# Altium schematic sheet 3.3V Buck Converter.SchDoc
size A; SheetNumber: 4; SheetTotal: 19
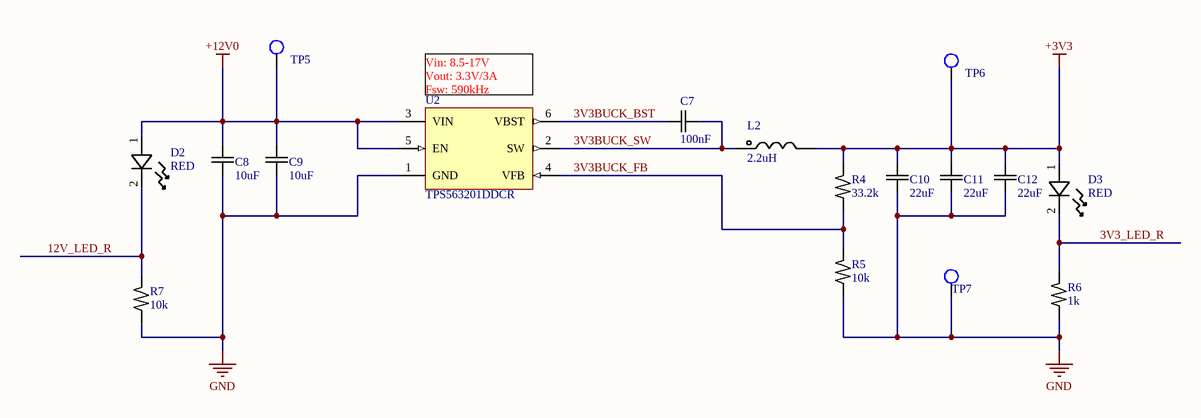
[diagram p0: 3.3V Buck Converter.SchDoc]

## Parts
C7  100nF  [C0603]
C8  10uF  [C1206]
C9  10uF  [C1206]
C10  22uF  [C1206]
C11  22uF  [C1206]
C12  22uF  [C1206]
D2  RED  [LED0805 RED]
D3  RED  [LED0805 RED]
L2  2.2uH  [Coil 7.2x6.6]
R4  33.2k  [R0603]
R5  10k  [R0603]
R6  1k  [R0603]
R7  10k  [R0603]
TP5  TestPoint  [TESTPOINT_SMD_1.27MM]  (value not drawn)  (no BOM)
TP6  TestPoint  [TESTPOINT_SMD_1.27MM]  (value not drawn)  (no BOM)
TP7  TestPoint  [TESTPOINT_SMD_1.27MM]  (value not drawn)  (no BOM)
U2  TPS563201DDCR  [SOT23-6]

## Nets
+3V3: C10.1 C11.1 C12.1 D3.1 L2.2 R4.2 TP6.1
+12V0: C8.2 C9.2 D2.1 TP5.1 U2.3(VIN) U2.5(EN)
GND: C8.1 C9.1 C10.2 C11.2 C12.2 R5.1 R6.1 R7.1 TP7.1 U2.1(GND)
3V3_LED_R: D3.2 R6.2
3V3BUCK_BST: C7.1 U2.6(VBST)
3V3BUCK_FB: R4.1 R5.2 U2.4(VFB)
3V3BUCK_SW: C7.2 L2.1 U2.2(SW)
12V_LED_R: D2.2 R7.2

## Notes on the sheet
- (near U2) Vin: 8.5-17V
  Vout: 3.3V/3A
  Fsw: 590kHz
- Project:
- Sheet Title:
- Size
- Date:
- A
- Sheet Number:
- Sheet Total:
- Revision:
- Time:
- Author:

## Library data of the parts
C7 = Cap_cer: CAP CER 100nF 50V X7R 0603; MF: HRE; MP: CGA0603X7R104K500JT; ComponentLink1Description: Datasheet; ComponentLink1URL: https://www.lcsc.com/datasheet/C6119867.pdf; ComponentLink2Description: Supplier1; ComponentLink2URL: https://www.lcsc.com/product-detail/C6119867.html
C8 C9 = Cap_cer: CAP CER 10uF 25V X7R 1206; MF: SAMWHA; MP: CS3216X7R106K250NRI; ComponentLink1Description: Datasheet; ComponentLink1URL: https://www.lcsc.com/datasheet/C513767.pdf; ComponentLink2Description: Supplier1; ComponentLink2URL: https://www.lcsc.com/product-detail/C513767.html
C10-C12 = Cap_cer: CAP CER 22uF 10V X7R 1206; MF: CCTC; MP: TCC1206X7R226K100HT; ComponentLink1Description: Datasheet; ComponentLink1URL: https://www.lcsc.com/datasheet/C20416445.pdf; ComponentLink2Description: Supplier1; ComponentLink2URL: https://www.lcsc.com/product-detail/C20416445.html
D2 D3 = LED: LED RED WATER CLEAR 0805 SMD; MF: XINGLIGHT; MP: XL-TD2012SURC; ComponentLink1Description: Datasheet; ComponentLink1URL: https://www.lcsc.com/datasheet/C5349939.pdf; ComponentLink2Description: Supplier1; ComponentLink2URL: https://www.lcsc.com/product-detail/C5349939.html
L2 = Coil: FIXED IND 2.2uH 9.5A 11.2mΩ SMD,7.2x6.6mm; MF: SHOU HAN; MP: CYA0650-2.2UH; ComponentLink1Description: Datasheet; ComponentLink1URL: https://www.lcsc.com/datasheet/C5189752.pdf; ComponentLink2Description: Supplier1; ComponentLink2URL: https://www.lcsc.com/product-detail/C5189752.html
R4 = Res: RES 33.2kΩ ±1% 100mW 0603; MF: FOJAN; MP: FRC0603F3322TS; ComponentLink1Description: Datasheet; ComponentLink1URL: https://www.lcsc.com/datasheet/C2933200.pdf; ComponentLink2Description: Supplier1; ComponentLink2URL: https://www.lcsc.com/product-detail/C2933200.html
R5 R7 = Res: RES 10kΩ ±1% 100mW 0603; MF: FOJAN; MP: FRC0603F1002TS; ComponentLink1Description: Datasheet; ComponentLink1URL: https://www.lcsc.com/datasheet/C2906982.pdf; ComponentLink2Description: Supplier1; ComponentLink2URL: https://www.lcsc.com/product-detail/C2906982.html
R6 = Res: RES 1kΩ ±5% 100mW 0603; MF: VO; MP: SCR0603J1K; ComponentLink1Description: Datasheet; ComponentLink1URL: https://www.lcsc.com/datasheet/C3017736.pdf; ComponentLink2Description: Supplier1; ComponentLink2URL: https://www.lcsc.com/product-detail/C3017736.html
U2 = TPS563201DDCR: 580kHz 3A Buck Adjustable 768mV~7V 1 SOT-23-THIN-6 Voltage Regulators - DC DC Switching Regulators ROHS; MF: Texas Instruments; ComponentLink1Description: Datasheet; ComponentLink1URL: https://www.lcsc.com/datasheet/C116592.pdf; ComponentLink2Description: Supplier1; ComponentLink2URL: https://www.lcsc.com/product-detail/C116592.html; MP: TPS563201DDCR